# Altium schematic sheet PotsDuino.SchDoc
size A3; DocumentNumber: 1; SheetNumber: 1; SheetTotal: 2
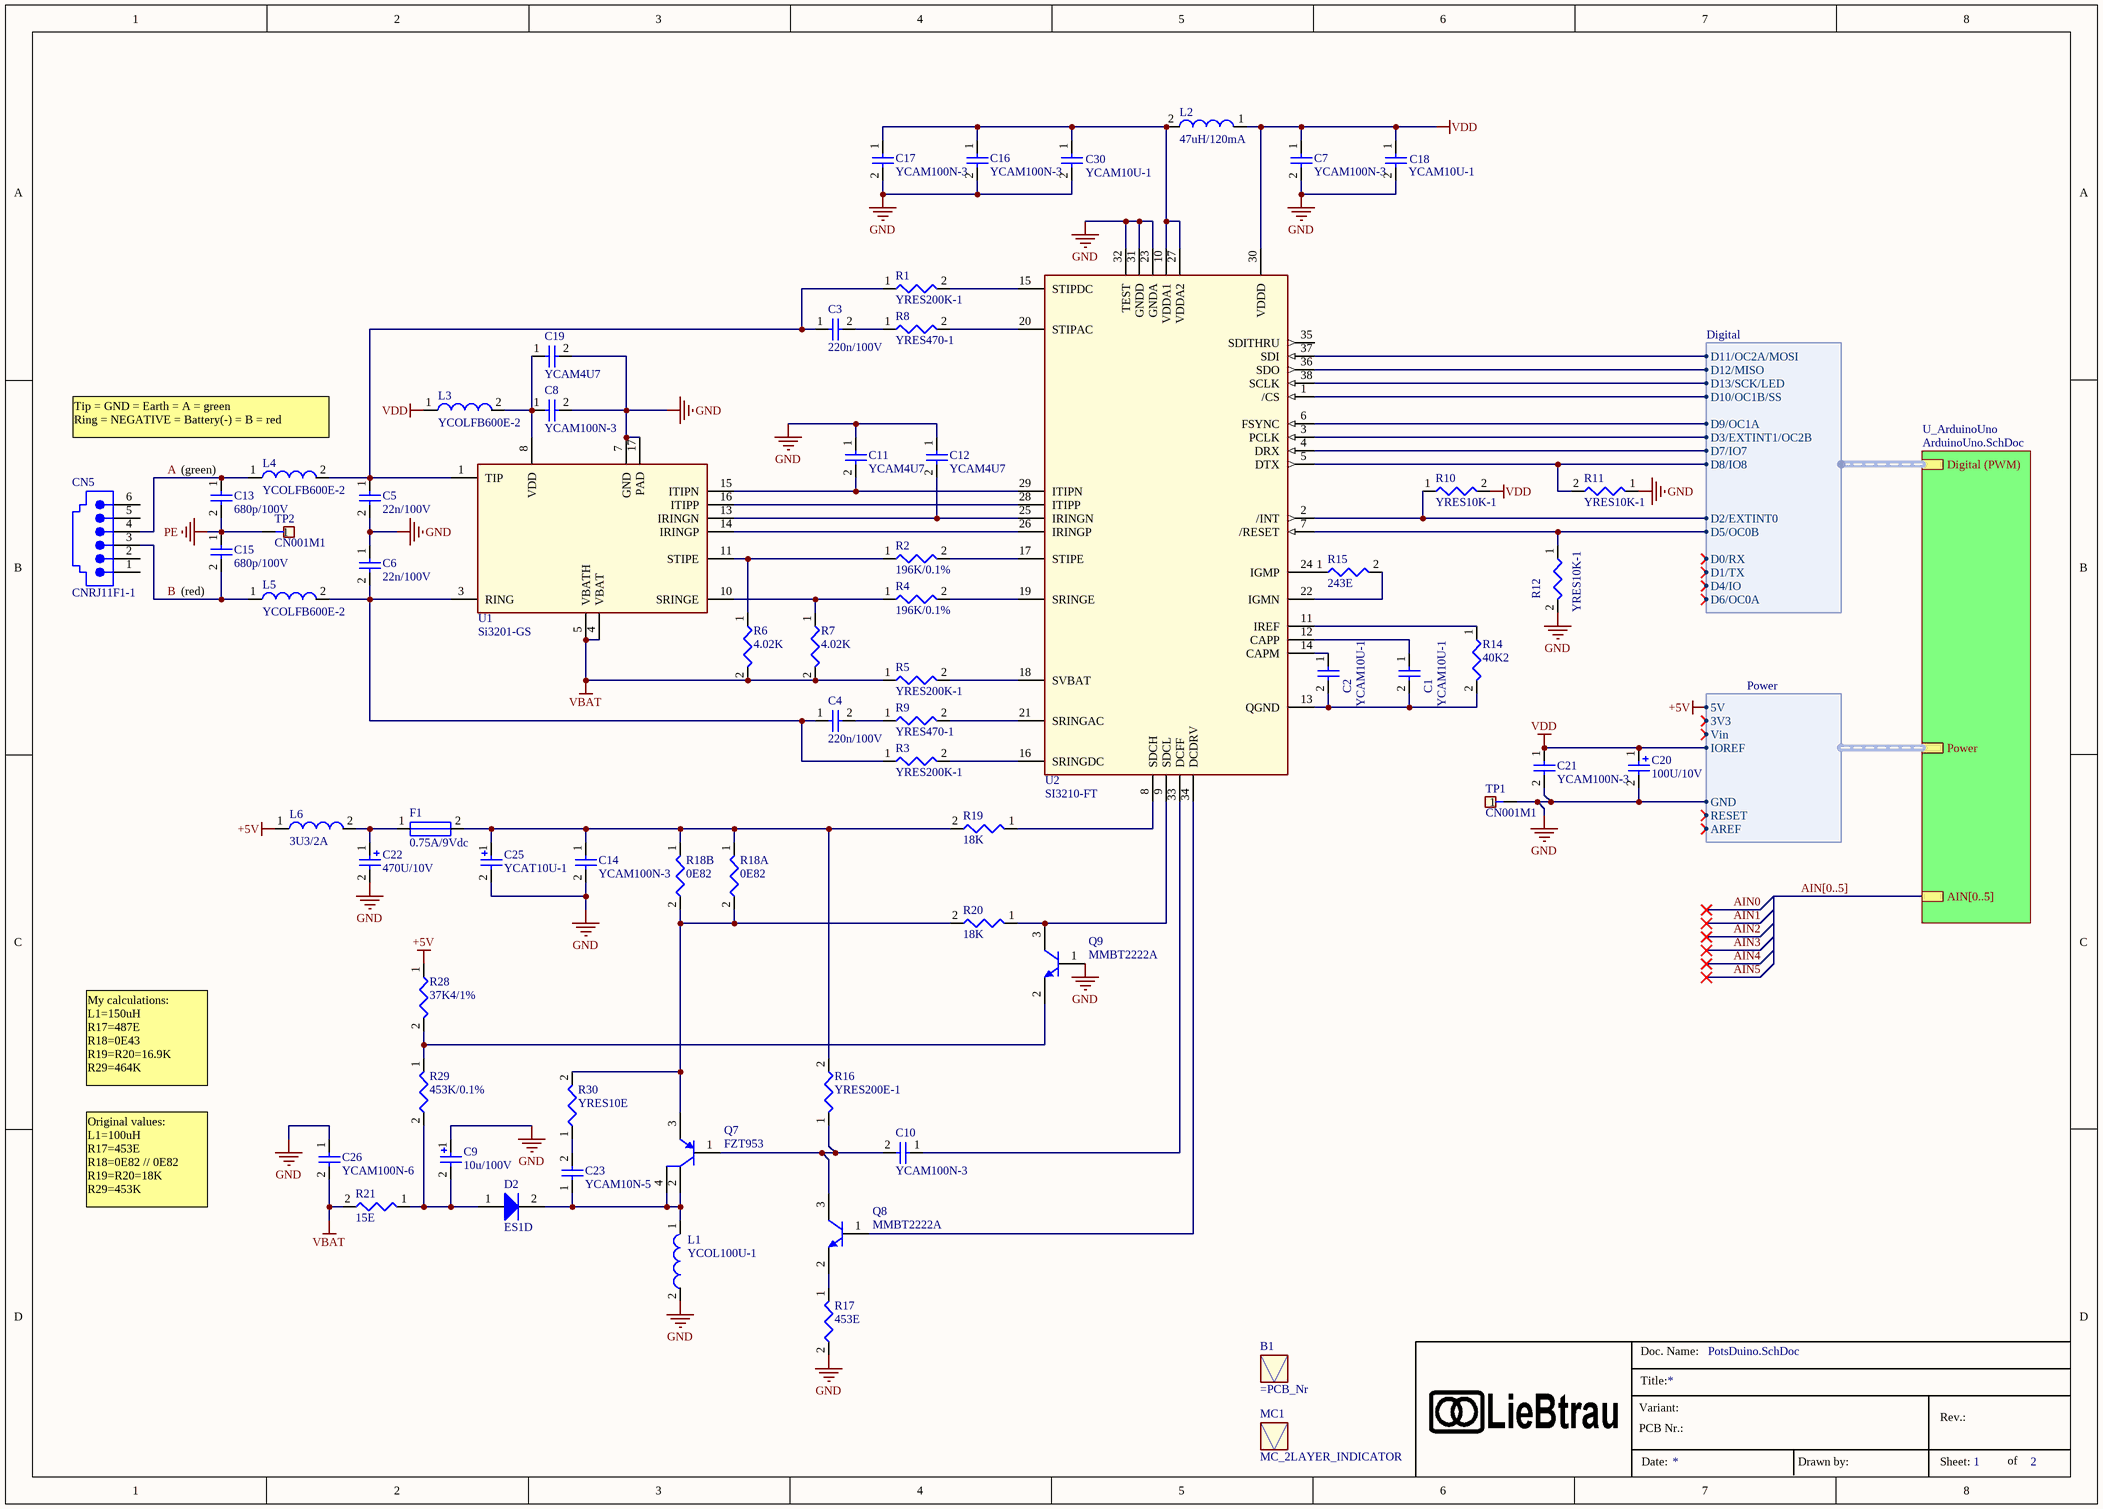
[diagram p0: PotsDuino.SchDoc]

## Parts
B1  (no value)  [=PCB_Nr]  (mechanical)
C1  YCAM10U-1  [CA_0805]
C2  YCAM10U-1  [CA_0805]
C3  220n/100V  [CA_0805]
C4  220n/100V  [CA_0805]
C5  22n/100V  [CA_0603]
C6  22n/100V  [CA_0603]
C7  YCAM100N-3  [CA_0603]
C8  YCAM100N-3  [CA_0603]
C9  10u/100V  [CA_CANTHD63P25_H110_R]
C10  YCAM100N-3  [CA_0603]
C11  YCAM4U7  [CA_1206]
C12  YCAM4U7  [CA_1206]
C13  680p/100V  [CA_0603]
C14  YCAM100N-3  [CA_0603]
C15  680p/100V  [CA_0603]
C16  YCAM100N-3  [CA_0603]
C17  YCAM100N-3  [CA_0603]
C18  YCAM10U-1  [CA_0805]
C19  YCAM4U7  [CA_1206]
C20  100U/10V  [CA_CANTHD50P20_H110]
C21  YCAM100N-3  [CA_0603]
C22  470U/10V  [CA_CANTHD80P35_H110]
C23  YCAM10N-5  [CA_1206]
C25  YCAT10U-1  [CA_1210_H21]
C26  YCAM100N-6  [CA_0805]
C30  YCAM10U-1  [CA_0805]
CN5  CNRJ11F1-1  [CN_MODJACK_6P]
D2  ES1D  [DI_DO-214AC]
F1  0.75A/9Vdc  [RE_0805]
L1  YCOL100U-1  [CL_WE-PD4]
L2  47uH/120mA  [CL_0805]
L3  YCOLFB600E-2  [CL_0603]
L4  YCOLFB600E-2  [CL_0603]
L5  YCOLFB600E-2  [CL_0603]
L6  3U3/2A  [CL_BOURNS_SDR0604_58x60]
MC1  MC_2LAYER_INDICATOR  [MC_2LAYER_INDICATOR]  (no BOM)
Q7  FZT953  [SC_SOT223]
Q8  MMBT2222A  [SC_SOT23]
Q9  MMBT2222A  [SC_SOT23]
R1  YRES200K-1  [RE_0603]
R2  196K/0.1%  [RE_0603]
R3  YRES200K-1  [RE_0603]
R4  196K/0.1%  [RE_0603]
R5  YRES200K-1  [RE_0603]
R6  4.02K  [RE_1206]
R7  4.02K  [RE_1206]
R8  YRES470-1  [RE_0603]
R9  YRES470-1  [RE_0603]
R10  YRES10K-1  [RE_0603]
R11  YRES10K-1  [RE_0603]
R12  YRES10K-1  [RE_0603]
R14  40K2  [RE_0603]
R15  243E  [RE_0603]
R16  YRES200E-1  [RE_0603]
R17  453E  [RE_0805]
R18A  0E82  [RE_0805]
R18B  0E82  [RE_0805]
R19  18K  [RE_0603]
R20  18K  [RE_0603]
R21  15E  [RE_0805]
R28  37K4/1%  [RE_1206]
R29  453K/0.1%  [RE_0805]
R30  YRES10E  [RE_1206]
TP1  CN001M1  [CN_TP_TH_1.3mm]  (no BOM)
TP2  CN001M1  [CN_TP_TH_1.3mm]  (no BOM)
U1  Si3201-GS  [SC_ESOIC16]
U2  SI3210-FT  [SC_TSSOP38]

## Sub-sheets
U_ArduinoUno = ArduinoUno.SchDoc: Digital (PWM) (harness Digital), Power (harness Power), AIN[0..5]

## Harnesses
Power: RESET, 3V3, 5V, GND, Vin, AREF, IOREF
Digital: D0/RX, D1/TX, D2/EXTINT0, D3/EXTINT1/OC2B, D4/IO, D5/OC0B, D6/OC0A, D7/IO7, D9/OC1A, D10/OC1B/SS, D11/OC2A/MOSI, D12/MISO, D13/SCK/LED, D8/IO8

## Nets
+5V: L6.1 R28.1 ; sheet U_ArduinoUno/Power.5V
GND: C5.2 C6.1 C7.2 C8.2 C9.1 C11.1 C12.1 C14.2 C16.2 C17.2 C18.2 C19.2 C20.2 C21.2 C22.2 C25.2 C26.1 C30.2 L1.2 Q9.1(C) R11.1 R12.2 R17.2 TP1.1 U1.7(GND) U1.17(PAD) U2.23(GNDA) U2.31(GNDD) U2.32(TEST) ; sheet U_ArduinoUno/Power.GND
PE: C13.2 C15.1 TP2.1
VBAT: C26.2 R5.1 R6.2 R7.2 R21.2 U1.4(VBAT) U1.5(VBATH)
VDD: C7.1 C18.1 C20.1 C21.1 L2.1 L3.1 R10.2 U2.30(VDDD) ; sheet U_ArduinoUno/Power.IOREF
A: C13.1 CN5.4 L4.1
B: C15.2 CN5.3 L5.1
NetC1_1: C1.1 U2.12(CAPP)
NetC1_2: C1.2 C2.2 R14.2 U2.13(QGND)
NetC2_1: C2.1 U2.14(CAPM)
NetC3_1: C3.1 C5.1 L4.2 R1.1 U1.1(TIP)
NetC3_2: C3.2 R8.1
NetC4_1: C4.1 C6.2 L5.2 R3.1 U1.3(RING)
NetC4_2: C4.2 R9.1
NetC8_1: C8.1 C19.1 L3.2 U1.8(VDD)
NetC9_2: C9.2 D2.1(A) R21.1 R29.2
NetC10_1: C10.1 U2.33(DCFF)
NetC10_2: C10.2 Q7.1(C) Q8.3(E) R16.1
NetC11_2: C11.2 U1.15(ITIPN) U2.29(ITIPN)
NetC12_2: C12.2 U1.13(IRINGN) U2.25(IRINGN)
NetC14_1: C14.1 C25.1 F1.2 R16.2 R18A.1 R18B.1 R19.2
NetC16_1: C16.1 C17.1 C30.1 L2.2 U2.10(VDDA1) U2.27(VDDA2)
NetC22_1: C22.1 F1.1 L6.2
NetC23_1: C23.1 D2.2(K) L1.1 Q7.2(B) Q7.4
NetC23_2: C23.2 R30.1
NetQ7_3: Q7.3(E) R18A.2 R18B.2 R20.2 R30.2
NetQ8_1: Q8.1(C) U2.34(DCDRV)
NetQ8_2: Q8.2(B) R17.1
NetQ9_2: Q9.2(B) R28.2 R29.1
NetQ9_3: Q9.3(E) R20.1 U2.9(SDCL)
NetR1_2: R1.2 U2.15(STIPDC)
NetR2_1: R2.1 R6.1 U1.11(STIPE)
NetR2_2: R2.2 U2.17(STIPE)
NetR3_2: R3.2 U2.16(SRINGDC)
NetR4_1: R4.1 R7.1 U1.10(SRINGE)
NetR4_2: R4.2 U2.19(SRINGE)
NetR5_2: R5.2 U2.18(SVBAT)
NetR8_2: R8.2 U2.20(STIPAC)
NetR9_2: R9.2 U2.21(SRINGAC)
NetR10_1: R10.1 U2.2(/INT) ; sheet U_ArduinoUno/Digital (PWM).D2/EXTINT0
NetR11_2: R11.2 U2.5(DTX) ; sheet U_ArduinoUno/Digital (PWM).D8/IO8
NetR12_1: R12.1 U2.7(/RESET) ; sheet U_ArduinoUno/Digital (PWM).D5/OC0B
NetR14_1: R14.1 U2.11(IREF)
NetR15_1: R15.1 U2.24(IGMP)
NetR15_2: R15.2 U2.22(IGMN)
NetR19_1: R19.1 U2.8(SDCH)
NetU1_14: U1.14(IRINGP) U2.26(IRINGP)
NetU1_16: U1.16(ITIPP) U2.28(ITIPP)
NetU2_1: U2.1(/CS) ; sheet U_ArduinoUno/Digital (PWM).D10/OC1B/SS
NetU2_3: U2.3(PCLK) ; sheet U_ArduinoUno/Digital (PWM).D3/EXTINT1/OC2B
NetU2_4: U2.4(DRX) ; sheet U_ArduinoUno/Digital (PWM).D7/IO7
NetU2_6: U2.6(FSYNC) ; sheet U_ArduinoUno/Digital (PWM).D9/OC1A
NetU2_36: U2.36(SDO) ; sheet U_ArduinoUno/Digital (PWM).D12/MISO
NetU2_37: U2.37(SDI) ; sheet U_ArduinoUno/Digital (PWM).D11/OC2A/MOSI
NetU2_38: U2.38(SCLK) ; sheet U_ArduinoUno/Digital (PWM).D13/SCK/LED

Not connected (* = marked no-connect by the designer): CN5 1 2 5 6; U2 35(SDITHRU)

## Buses and harness runs
bus AIN[0..5] = sheet U_ArduinoUno/AIN[0..5]

## Notes on the sheet
- Tip = GND = Earth = A = green
  Ring = NEGATIVE = Battery(-) = B = red
- (near C13) (green)
- (near C15) (red)
- My calculations:
  L1=150uH
  R17=487E
  R18=0E43
  R19=R20=16.9K
  R29=464K
- Original values:
  L1=100uH
  R17=453E
  R18=0E82 // 0E82
  R19=R20=18K
  R29=453K
- Title:
- Doc. Name:
- Variant:
- PCB Nr.:
- Date:
- Drawn by:
- Rev.:
- Sheet:
- of

## Library data of the parts
B1 = BARE_PCB: Part Number: BARE_PCB
C1 C2 C18 C30 = YCAM10U-1: Order Code: Farnell 1845738; Part Number: YCAM10U-1; Component Type: capacitor
C3 C4 = MCCA000493: Manufacturer: Multicomp; Order Code: Farnell 1793829; Part Number: MCCA000493; Component Type: capacitor
C5 C6 = C0603C223K1RACTU: Manufacturer: Kemet; Order Code: Farnell 1865548; Part Number: C0603C223K1RACTU; Component Type: capacitor
C7 C8 C10 C14 C16 C17 C21 = YCAM100N-3: Order Code: Farnell 1759037; Part Number: YCAM100N-3; Component Type: capacitor
C9 = 100YXF10MEFC6.3X11: Manufacturer: Rubycon; Order Code: Farnell 1144640; Part Number: 100YXF10MEFC6.3X11; Component Type: capacitor
C11 C12 C19 = YCAM4U7: Order Code: Farnell 1828810; Part Number: YCAM4U7; Component Type: capacitor
C13 C15 = C0603C681J1GACTU: Manufacturer: Kemet; Order Code: Farnell 1813442; Part Number: C0603C681J1GACTU; Component Type: capacitor
C20 = MCGPR10V107M5X11: Manufacturer: Multicomp; Order Code: Farnell 1902882; Part Number: MCGPR10V107M5X11; Component Type: capacitor
C22 = MCGPR10V477M8X11: Manufacturer: Multicomp; Order Code: Farnell 1902884; Part Number: MCGPR10V477M8X11; Component Type: capacitor
C23 = YCAM10N-5: Manufacturer: Yageo (Phycomp); Order Code: Farnell 1284146; Part Number: YCAM10N-5; Component Type: capacitor
CN5 = CNRJ11F1-1: Order Code: Farnell 1536490; Part Number: CNRJ11F1-1; Component Type: connector
D2 = ES1D: 1 Amp General Purpose Rectifier; Manufacturer: Fairchild Semiconductor; Order Code: Farnell 1470967; Part Number: ES1D; Component Type: diode
F1 = MC36210: Manufacturer: Multicomp; Order Code: Farnell 1861196; Part Number: MC36210; Component Type: fuse
L1 = YCOL100U-1: Manufacturer: Wuerth Elektronik; Order Code: Farnell 1636137; Part Number: YCOL100U-1; Component Type: inductor
L2 = L0805C470MDWIT: Manufacturer: Kemet; Order Code: Farnell 1457862; Part Number: L0805C470MDWIT; Component Type: inductor
L3-L5 = YCOLFB600E-2: Manufacturer: Murata; Order Code: Farnell 1515679; Part Number: YCOLFB600E-2; Component Type: inductor
L6 = MCSDC0604-3R3MU: Manufacturer: Multicomp; Order Code: Farnell 1864163; Part Number: MCSDC0604-3R3MU; Component Type: inductor
Q7 = FZT953: Amplifier Transistor NPN Silicon; Manufacturer: Diodes Inc.; Order Code: Farnell 9526358; Part Number: FZT953; Component Type: transistor
Q8 Q9 = MMBT2222A: Amplifier Transistor NPN Silicon; Manufacturer: Fairchild Semiconductor; Order Code: Farnell 9846700; Part Number: MMBT2222A; Component Type: transistor
R1 R3 R5 = YRES200K-1: Resistor; Order Code: Farnell 9330780; Part Number: YRES200K-1; Component Type: resistor
R2 R4 = ERA3AEB1963V: Resistor; Manufacturer: Panasonic Electronic Components; Order Code: Farnell 1171014 RS 708-9108; Part Number: ERA3AEB1963V; Component Type: resistor
R6 R7 = CRCW12064K02FKEA: Resistor; Manufacturer: Vishay Draloric; Order Code: Farnell 1470011; Part Number: CRCW12064K02FKEA; Component Type: resistor
R8 R9 = YRES470-1: Resistor; Part Number: YRES470-1; Component Type: resistor
R10-R12 = YRES10K-1: Resistor; Part Number: YRES10K-1; Component Type: resistor
R14 = MC 0.063W 0603 1% 40K2: Resistor; Manufacturer: Multicomp; Order Code: Farnell 1170948; Part Number: MC 0.063W 0603 1% 40K2; Component Type: resistor
R15 = MC 0.063W 0603 1% 243R: Resistor; Manufacturer: Multicomp; Order Code: Farnell 1170724; Part Number: MC 0.063W 0603 1% 243R; Component Type: resistor
R16 = YRES200E-1: Resistor; Order Code: Farnell 9330755; Part Number: YRES200E-1; Component Type: resistor
R17 = MCTC0525B4530T5E: Resistor; Manufacturer: Multicomp; Order Code: Farnell 1575710; Part Number: MCTC0525B4530T5E; Component Type: resistor
R18A R18B = ERJ6RQFR82V: Resistor; Manufacturer: Panasonic Electronic Components; Order Code: Farnell 1717798; Part Number: ERJ6RQFR82V; Component Type: resistor
R19 R20 = SG73S1JTTD1802F: Resistor; Manufacturer: KOA; Order Code: Farnell 1627782; Part Number: SG73S1JTTD1802F; Component Type: resistor
R21 = SG73P2ATTD15R0F: Resistor; Manufacturer: KOA; Order Code: Farnell 1399997; Part Number: SG73P2ATTD15R0F; Component Type: resistor
R28 = CRCW120637K4FKEA: Resistor; Manufacturer: Vishay Draloric; Order Code: Farnell 2139552; Part Number: CRCW120637K4FKEA; Component Type: resistor
R29 = MCTC0525B4533T5E: Resistor; Manufacturer: Multicomp; Order Code: Farnell 1576088; Part Number: MCTC0525B4533T5E; Component Type: resistor
R30 = YRES10E: Resistor; Manufacturer: Vishay Draloric; Part Number: YRES10E; Component Type: resistor
U1 = Si3201-GS: Manufacturer: Silicon Labs; Order Code: Mouser 634-SI3201-GS; Part Number: Si3201-GS; Component Type: communication
U2 = SI3210-FT: Manufacturer: Silicon Labs; Order Code: Mouser 634-SI3210-FT; Part Number: SI3210-FT; Component Type: communication
C25 = YCAT10U-1: Part Number: YCAT10U-1; Component Type: capacitor
C26 = YCAM100N-6: Part Number: YCAM100N-6; Component Type: capacitor
MC1 = MC_2LAYER_INDICATOR: Part Number: MC_2LAYER_INDICATOR
TP1 TP2 = CN001M1: Part Number: CN001M1; Component Type: testpin